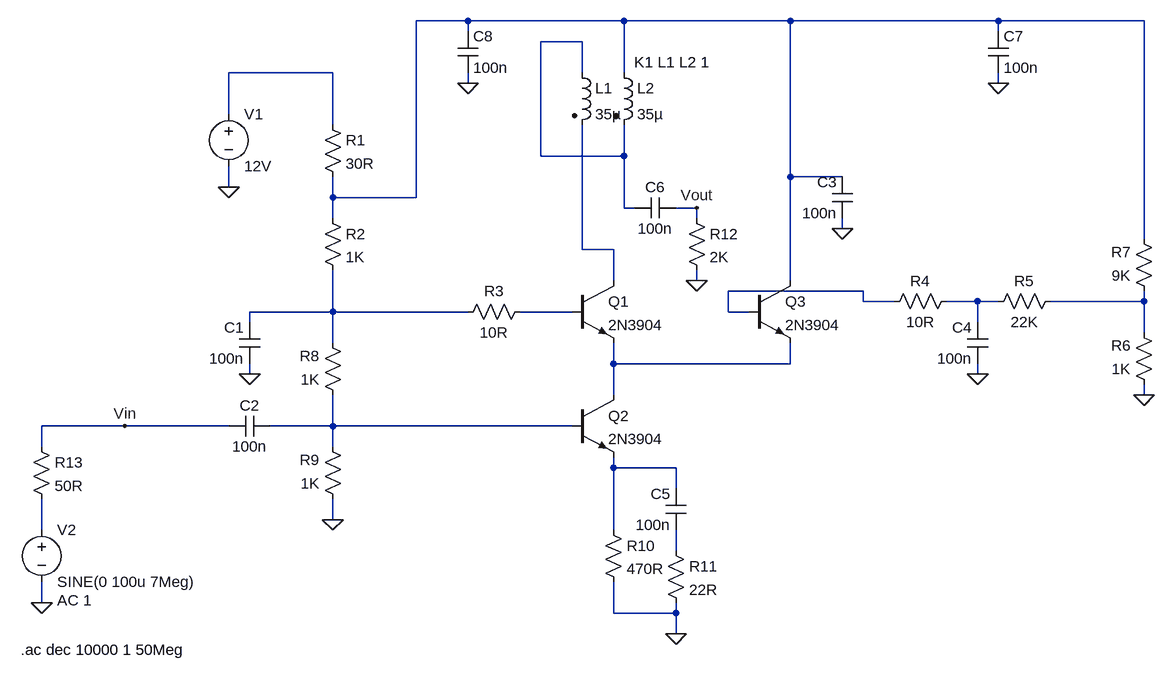
[diagram p0: schematic EMRFD RF Amp Testing.asc]
EMRFD RF Amp Testing.asc, the LTspice schematic file:
Version 4
SHEET 1 1028 696
WIRE -32 -288 -112 -288
WIRE 208 -288 -32 -288
WIRE 464 -288 208 -288
WIRE 784 -288 464 -288
WIRE 1008 -288 784 -288
WIRE -32 -272 -32 -288
WIRE 784 -272 784 -288
WIRE 144 -256 80 -256
WIRE -240 -208 -400 -208
WIRE 144 -208 144 -256
WIRE 208 -208 208 -288
WIRE -32 -192 -32 -208
WIRE 784 -192 784 -208
WIRE -400 -144 -400 -208
WIRE -240 -128 -240 -208
WIRE 80 -80 80 -256
WIRE 208 -80 208 -128
WIRE 208 -80 80 -80
WIRE 464 -48 464 -288
WIRE 544 -48 464 -48
WIRE -400 -32 -400 -64
WIRE -240 -16 -240 -48
WIRE -112 -16 -112 -288
WIRE -112 -16 -240 -16
WIRE 208 0 208 -80
WIRE 224 0 208 0
WIRE 320 0 288 0
WIRE -240 16 -240 -16
WIRE 320 16 320 0
WIRE 544 32 544 16
WIRE 1008 48 1008 -288
WIRE 144 64 144 -128
WIRE 192 64 144 64
WIRE 192 112 192 64
WIRE 320 112 320 96
WIRE 464 112 464 -48
WIRE 576 128 368 128
WIRE 576 144 576 128
WIRE 624 144 576 144
WIRE 752 144 704 144
WIRE 784 144 752 144
WIRE 1008 144 1008 128
WIRE 1008 144 864 144
WIRE -240 160 -240 96
WIRE -240 160 -368 160
WIRE -32 160 -240 160
WIRE 128 160 48 160
WIRE 368 160 368 128
WIRE 400 160 368 160
WIRE -368 176 -368 160
WIRE 752 176 752 144
WIRE 1008 192 1008 144
WIRE -240 208 -240 160
WIRE 192 240 192 208
WIRE 464 240 464 208
WIRE 464 240 192 240
WIRE -368 256 -368 240
WIRE 752 256 752 240
WIRE 192 288 192 240
WIRE 1008 288 1008 272
WIRE -560 336 -688 336
WIRE -400 336 -560 336
WIRE -240 336 -240 288
WIRE -240 336 -336 336
WIRE 128 336 -240 336
WIRE -688 368 -688 336
WIRE -240 368 -240 336
WIRE 192 400 192 384
WIRE 288 400 192 400
WIRE 288 432 288 400
WIRE -240 480 -240 448
WIRE -688 496 -688 448
WIRE 192 496 192 400
WIRE 288 528 288 496
WIRE -688 608 -688 576
WIRE 192 624 192 576
WIRE 288 624 288 608
WIRE 288 624 192 624
WIRE 288 656 288 624
FLAG -240 480 0
FLAG -368 256 0
FLAG 544 32 0
FLAG 752 256 0
FLAG 1008 288 0
FLAG 288 656 0
FLAG 320 112 0
FLAG -688 608 0
FLAG -400 -32 0
FLAG -32 -192 0
FLAG 784 -192 0
FLAG -560 336 Vin
FLAG 320 0 Vout
SYMBOL npn 128 112 R0
SYMATTR InstName Q1
SYMATTR Value 2N3904
SYMBOL npn 128 288 R0
SYMATTR InstName Q2
SYMATTR Value 2N3904
SYMBOL npn 400 112 R0
SYMATTR InstName Q3
SYMATTR Value 2N3904
SYMBOL ind2 128 -224 R0
SYMATTR InstName L1
SYMATTR Value 35µ
SYMATTR Type ind
SYMBOL ind2 192 -224 R0
SYMATTR InstName L2
SYMATTR Value 35µ
SYMATTR Type ind
SYMBOL res -256 -144 R0
SYMATTR InstName R1
SYMATTR Value 30R
SYMBOL res -256 0 R0
SYMATTR InstName R2
SYMATTR Value 1K
SYMBOL res 64 144 R90
WINDOW 0 0 56 VBottom 2
WINDOW 3 32 56 VTop 2
SYMATTR InstName R3
SYMATTR Value 10R
SYMBOL res 720 128 R90
WINDOW 0 0 56 VBottom 2
WINDOW 3 32 56 VTop 2
SYMATTR InstName R4
SYMATTR Value 10R
SYMBOL res 880 128 R90
WINDOW 0 0 56 VBottom 2
WINDOW 3 32 56 VTop 2
SYMATTR InstName R5
SYMATTR Value 22K
SYMBOL res 1024 288 R180
WINDOW 0 36 76 Left 2
WINDOW 3 36 40 Left 2
SYMATTR InstName R6
SYMATTR Value 1K
SYMBOL res 1024 144 R180
WINDOW 0 36 76 Left 2
WINDOW 3 36 40 Left 2
SYMATTR InstName R7
SYMATTR Value 9K
SYMBOL res -224 304 R180
WINDOW 0 36 76 Left 2
WINDOW 3 36 40 Left 2
SYMATTR InstName R8
SYMATTR Value 1K
SYMBOL res -224 464 R180
WINDOW 0 36 76 Left 2
WINDOW 3 36 40 Left 2
SYMATTR InstName R9
SYMATTR Value 1K
SYMBOL cap -352 240 R180
WINDOW 0 24 56 Left 2
WINDOW 3 24 8 Left 2
SYMATTR InstName C1
SYMATTR Value 100n
SYMBOL cap -400 352 R270
WINDOW 0 32 32 VTop 2
WINDOW 3 0 32 VBottom 2
SYMATTR InstName C2
SYMATTR Value 100n
SYMBOL cap 560 16 R180
WINDOW 0 24 56 Left 2
WINDOW 3 24 8 Left 2
SYMATTR InstName C3
SYMATTR Value 100n
SYMBOL cap 768 240 R180
WINDOW 0 24 56 Left 2
WINDOW 3 24 8 Left 2
SYMATTR InstName C4
SYMATTR Value 100n
SYMBOL cap 304 496 R180
WINDOW 0 24 56 Left 2
WINDOW 3 24 8 Left 2
SYMATTR InstName C5
SYMATTR Value 100n
SYMBOL res 176 480 R0
SYMATTR InstName R10
SYMATTR Value 470R
SYMBOL res 272 512 R0
SYMATTR InstName R11
SYMATTR Value 22R
SYMBOL cap 288 -16 R90
WINDOW 0 0 32 VBottom 2
WINDOW 3 32 32 VTop 2
SYMATTR InstName C6
SYMATTR Value 100n
SYMBOL res 304 0 R0
SYMATTR InstName R12
SYMATTR Value 2K
SYMBOL voltage -400 -160 R0
WINDOW 123 0 0 Left 2
WINDOW 39 0 0 Left 2
SYMATTR InstName V1
SYMATTR Value 12V
SYMBOL voltage -688 480 R0
WINDOW 123 24 124 Left 2
WINDOW 39 0 0 Left 2
SYMATTR InstName V2
SYMATTR Value SINE(0 100u 7Meg)
SYMATTR Value2 AC 1
SYMBOL res -704 352 R0
SYMATTR InstName R13
SYMATTR Value 50R
SYMBOL cap 768 -272 R0
SYMATTR InstName C7
SYMATTR Value 100n
SYMBOL cap -48 -272 R0
SYMATTR InstName C8
SYMATTR Value 100n
TEXT 224 -224 Left 2 !K1 L1 L2 1
TEXT -720 680 Left 2 !.ac dec 10000 1 50Meg

The netlist it stands for:
* EMRFD RF Amp Testing.asc
Q1 N004 N009 N010 0 2N3904
Q2 N010 N011 N012 0 2N3904
Q3 N001 N005 N010 0 2N3904
L1 N002 N004 35µ
L2 N001 N002 35µ
R1 N003 N001 30R
R2 N001 N008 1K
R3 N009 N008 10R
R4 N006 N005 10R
R5 N007 N006 22K
R6 0 N007 1K
R7 N007 N001 9K
R8 N011 N008 1K
R9 0 N011 1K
C1 0 N008 100n
C2 Vin N011 100n
C3 0 N001 100n
C4 0 N006 100n
C5 N014 N012 100n
R10 N012 0 470R
R11 N014 0 22R
C6 Vout N002 100n
R12 Vout 0 2K
V1 N003 0 12V
V2 N013 0 SINE(0 100u 7Meg) AC 1
R13 Vin N013 50R
C7 N001 0 100n
C8 N001 0 100n
.model NPN NPN
.model PNP PNP
.lib standard.bjt
K1 L1 L2 1
.ac dec 10000 1 50Meg
.backanno
.end